# Altium schematic sheet ROBOT BLOCK DIAGRAM.SchDoc
size A
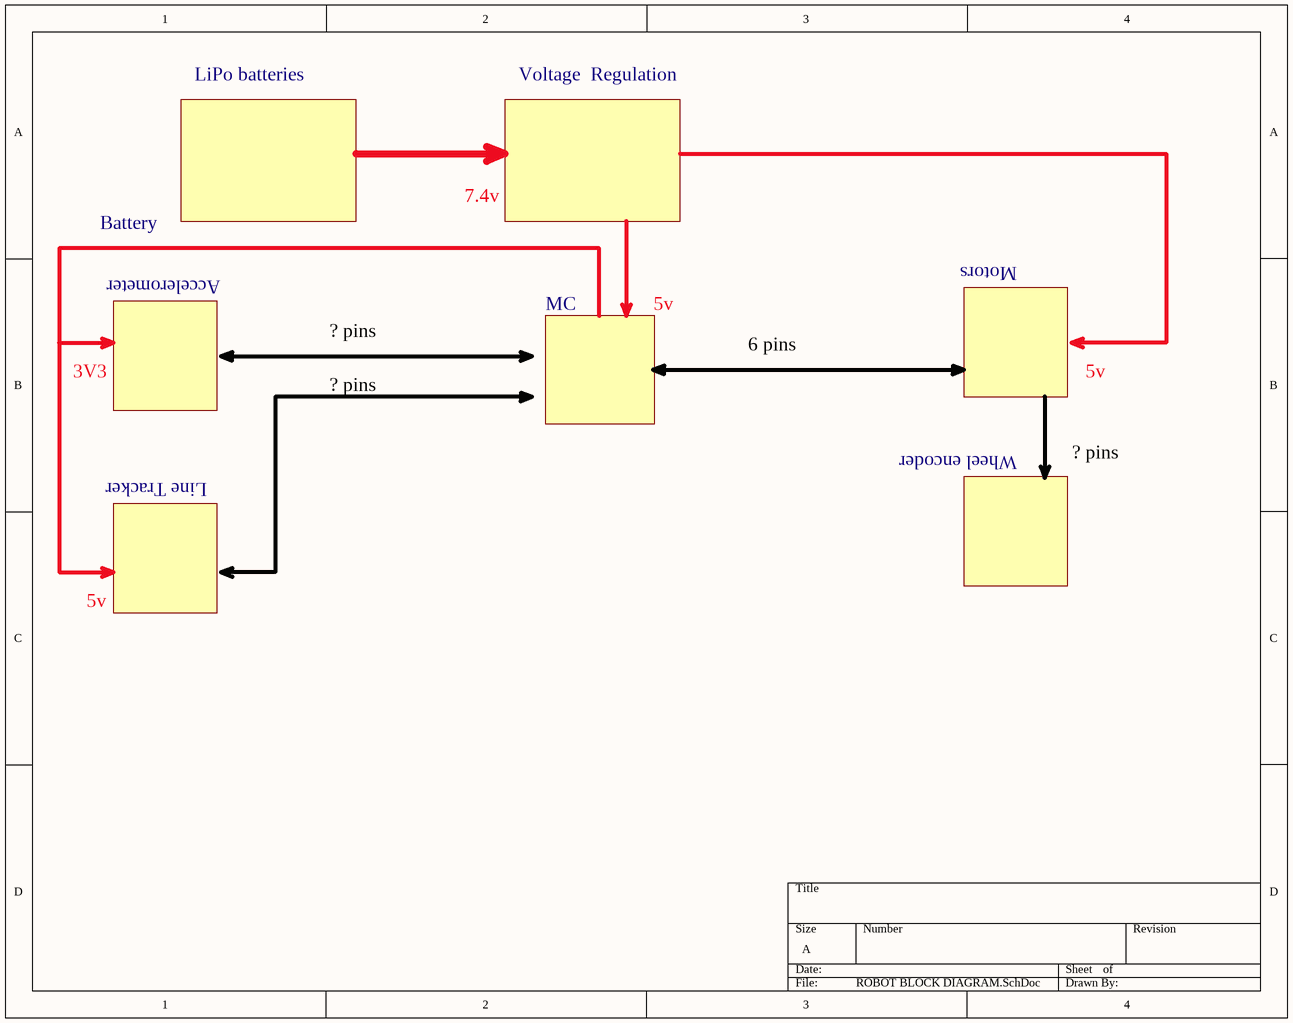
[diagram p0: ROBOT BLOCK DIAGRAM.SchDoc]

## Notes on the sheet
- LiPo batteries
- Voltage  Regulation
- Battery
- 7.4v
- Accelerometer
- Motors
- ? pins
- MC
- 5v
- 6 pins
- 3V3
- Line Tracker
- Wheel encoder